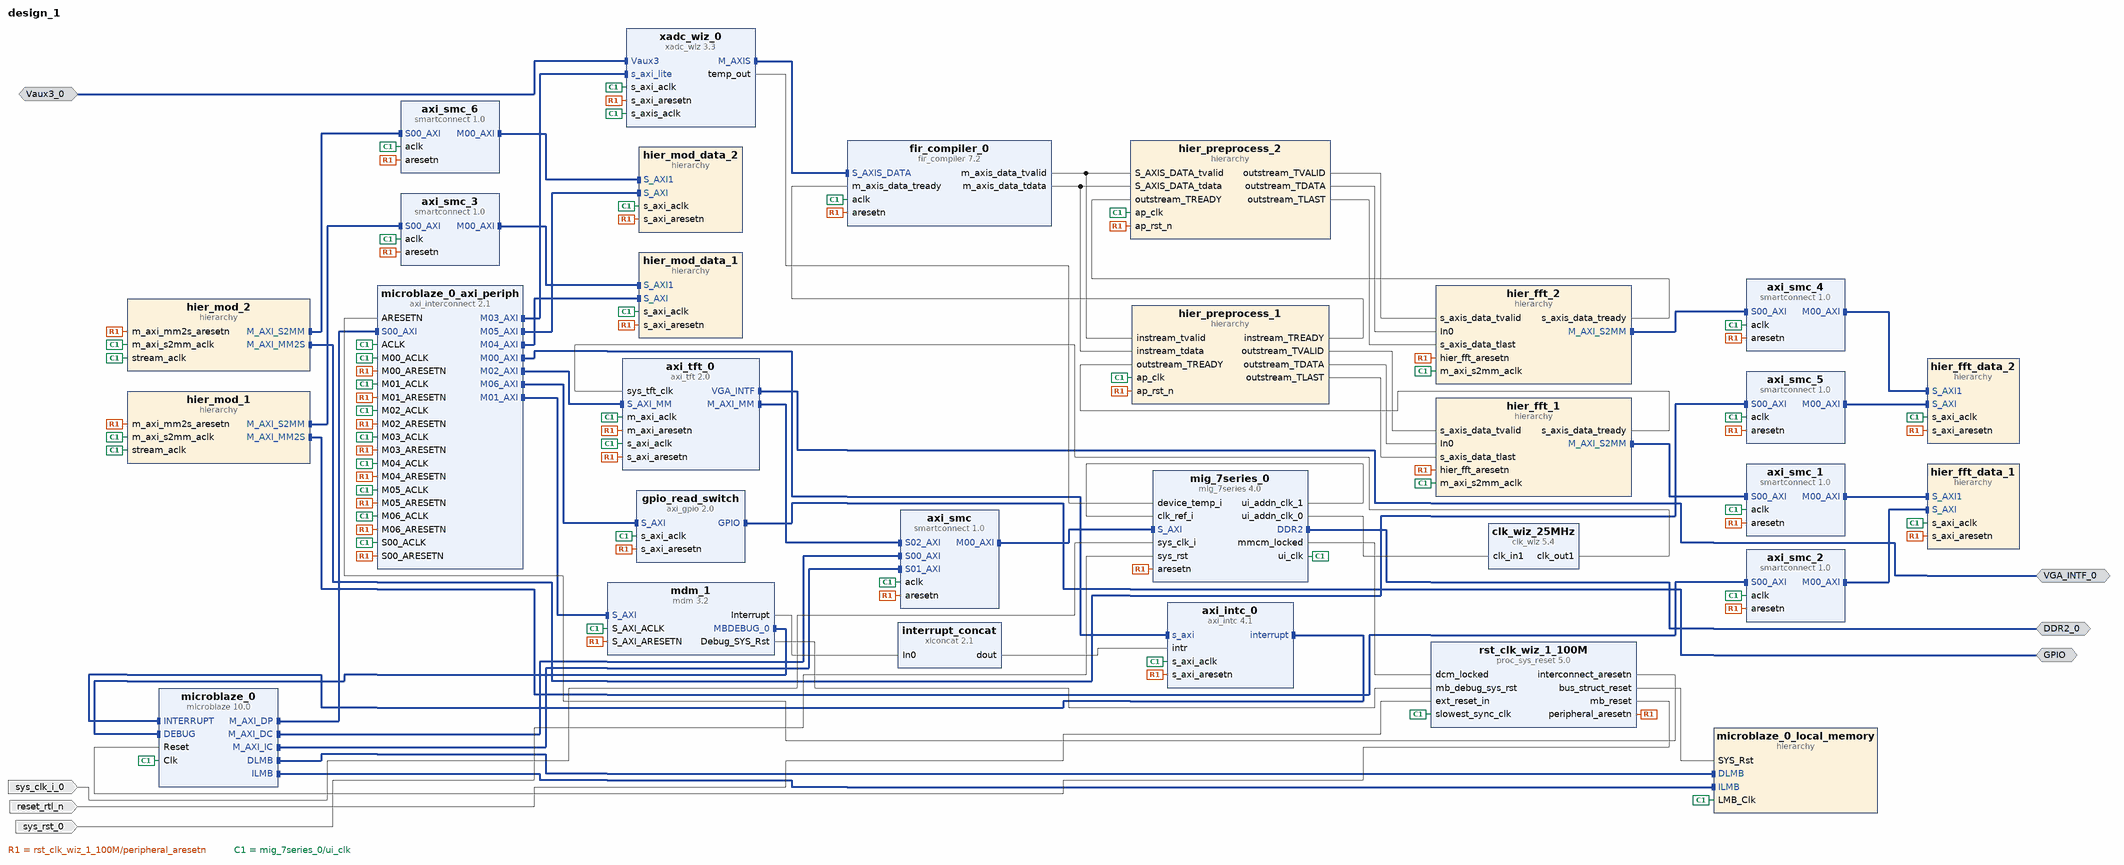
[diagram p0: block diagram of the top level]
# Vivado block design design_1, xc7a100tcsg324-1, Vivado 2017.4
create_bd_design design_1

create_bd_intf_port -mode Master -vlnv xilinx.com:interface:ddrx_rtl:1.0 DDR2_0
create_bd_intf_port -mode Master -vlnv xilinx.com:interface:vga_rtl:1.0 VGA_INTF_0
create_bd_intf_port -mode Slave -vlnv xilinx.com:interface:diff_analog_io_rtl:1.0 Vaux3_0
create_bd_intf_port -mode Master -vlnv xilinx.com:interface:gpio_rtl:1.0 GPIO
create_bd_port -dir I -type rst reset_rtl_n
set_property -dict {CONFIG.POLARITY ACTIVE_LOW} [get_bd_ports reset_rtl_n]
create_bd_port -dir I -type clk sys_clk_i_0
create_bd_port -dir I -type rst sys_rst_0

create_bd_cell -type ip -vlnv xilinx.com:ip:axi_interconnect:2.1 microblaze_0_axi_periph
set_property -dict {CONFIG.NUM_MI 7} [get_bd_cells microblaze_0_axi_periph]
create_bd_cell -type ip -vlnv xilinx.com:ip:xlconcat:2.1 interrupt_concat
set_property -dict {CONFIG.NUM_PORTS 1} [get_bd_cells interrupt_concat]
create_bd_cell -type ip -vlnv xilinx.com:ip:mig_7series:4.0 mig_7series_0
set_property -dict [list \
  CONFIG.XML_INPUT_FILE mig_b.prj \
  CONFIG.RESET_BOARD_INTERFACE Custom \
  CONFIG.BOARD_MIG_PARAM Custom \
] [get_bd_cells mig_7series_0]
create_bd_cell -type ip -vlnv xilinx.com:ip:axi_tft:2.0 axi_tft_0
set_property -dict [list \
  CONFIG.C_MAX_BURST_LEN 256 \
  CONFIG.C_M_AXI_DATA_WIDTH 128 \
  CONFIG.C_DEFAULT_TFT_BASE_ADDR 0x0000000087E00000 \
  CONFIG.C_EN_I2C_INTF 0 \
  CONFIG.C_TFT_INTERFACE 0 \
] [get_bd_cells axi_tft_0]
create_bd_cell -type ip -vlnv xilinx.com:ip:clk_wiz:5.4 clk_wiz_25MHz
set_property -dict [list \
  CONFIG.CLKOUT1_REQUESTED_OUT_FREQ 25 \
  CONFIG.USE_LOCKED false \
  CONFIG.USE_RESET false \
  CONFIG.RESET_PORT reset \
  CONFIG.MMCM_DIVCLK_DIVIDE 1 \
  CONFIG.MMCM_CLKFBOUT_MULT_F 9.125 \
  CONFIG.MMCM_CLKOUT0_DIVIDE_F 36.500 \
  CONFIG.RESET_TYPE ACTIVE_HIGH \
  CONFIG.CLKOUT1_JITTER 181.828 \
  CONFIG.CLKOUT1_PHASE_ERROR 104.359 \
] [get_bd_cells clk_wiz_25MHz]
create_bd_cell -type ip -vlnv xilinx.com:ip:smartconnect:1.0 axi_smc_1
set_property -dict {CONFIG.NUM_SI 1} [get_bd_cells axi_smc_1]
create_bd_cell -type hier hier_fft_1
create_bd_cell -type hier hier_fft_data_1
create_bd_cell -type ip -vlnv xilinx.com:ip:smartconnect:1.0 axi_smc_2
set_property -dict {CONFIG.NUM_SI 1} [get_bd_cells axi_smc_2]
create_bd_cell -type ip -vlnv xilinx.com:ip:smartconnect:1.0 axi_smc_3
set_property -dict {CONFIG.NUM_SI 1} [get_bd_cells axi_smc_3]
create_bd_cell -type hier hier_mod_1
create_bd_cell -type hier hier_mod_data_1
create_bd_cell -type ip -vlnv xilinx.com:ip:smartconnect:1.0 axi_smc
set_property -dict {CONFIG.NUM_SI 3} [get_bd_cells axi_smc]
create_bd_cell -type hier hier_preprocess_1
create_bd_cell -type ip -vlnv xilinx.com:ip:axi_intc:4.1 axi_intc_0
create_bd_cell -type ip -vlnv xilinx.com:ip:mdm:3.2 mdm_1
set_property -dict {CONFIG.C_USE_UART 1} [get_bd_cells mdm_1]
create_bd_cell -type ip -vlnv xilinx.com:ip:microblaze:10.0 microblaze_0
set_property -dict [list \
  CONFIG.C_D_AXI 1 \
  CONFIG.C_D_LMB 1 \
  CONFIG.C_I_LMB 1 \
  CONFIG.G_TEMPLATE_LIST 2 \
  CONFIG.C_USE_MSR_INSTR 1 \
  CONFIG.C_USE_PCMP_INSTR 1 \
  CONFIG.C_USE_BARREL 1 \
  CONFIG.C_USE_DIV 1 \
  CONFIG.C_USE_HW_MUL 1 \
  CONFIG.C_USE_FPU 1 \
  CONFIG.C_DEBUG_ENABLED 2 \
  CONFIG.C_USE_ICACHE 1 \
  CONFIG.C_ADDR_TAG_BITS 12 \
  CONFIG.C_CACHE_BYTE_SIZE 32768 \
  CONFIG.C_ICACHE_LINE_LEN 8 \
  CONFIG.C_ICACHE_VICTIMS 8 \
  CONFIG.C_ICACHE_STREAMS 1 \
  CONFIG.C_USE_DCACHE 1 \
  CONFIG.C_DCACHE_ADDR_TAG 12 \
  CONFIG.C_DCACHE_BYTE_SIZE 32768 \
  CONFIG.C_DCACHE_LINE_LEN 8 \
  CONFIG.C_DCACHE_USE_WRITEBACK 1 \
  CONFIG.C_DCACHE_VICTIMS 8 \
  CONFIG.C_USE_BRANCH_TARGET_CACHE 1 \
] [get_bd_cells microblaze_0]
create_bd_cell -type ip -vlnv xilinx.com:ip:proc_sys_reset:5.0 rst_clk_wiz_1_100M
create_bd_cell -type hier microblaze_0_local_memory
create_bd_cell -type ip -vlnv xilinx.com:ip:xadc_wiz:3.3 xadc_wiz_0
set_property -dict [list \
  CONFIG.XADC_STARUP_SELECTION simultaneous_sampling \
  CONFIG.DCLK_FREQUENCY 81.25 \
  CONFIG.ADC_CONVERSION_RATE 1000 \
  CONFIG.SEQUENCER_MODE Off \
  CONFIG.OT_ALARM false \
  CONFIG.USER_TEMP_ALARM false \
  CONFIG.VCCINT_ALARM false \
  CONFIG.VCCAUX_ALARM false \
  CONFIG.CHANNEL_ENABLE_TEMPERATURE true \
  CONFIG.CHANNEL_ENABLE_VP_VN true \
  CONFIG.CHANNEL_ENABLE_VAUXP3_VAUXN3 true \
  CONFIG.CHANNEL_ENABLE_VAUXP11_VAUXN11 true \
  CONFIG.BIPOLAR_VAUXP3_VAUXN3 true \
  CONFIG.BIPOLAR_VAUXP11_VAUXN11 true \
  CONFIG.ENABLE_TEMP_BUS true \
  CONFIG.ENABLE_AXI4STREAM true \
] [get_bd_cells xadc_wiz_0]
create_bd_cell -type hier hier_preprocess_2
create_bd_cell -type ip -vlnv xilinx.com:ip:fir_compiler:7.2 fir_compiler_0
set_property -dict [list \
  CONFIG.CoefficientSource COE_File \
  CONFIG.Coefficient_File {../../../../imports/MATLAB/coe file2.coe} \
  CONFIG.Coefficient_Sets 1 \
  CONFIG.Coefficient_Reload false \
  CONFIG.Filter_Type Decimation \
  CONFIG.Interpolation_Rate 1 \
  CONFIG.Decimation_Rate 4 \
  CONFIG.Zero_Pack_Factor 1 \
  CONFIG.Number_Channels 1 \
  CONFIG.RateSpecification Frequency_Specification \
  CONFIG.SamplePeriod 1 \
  CONFIG.Sample_Frequency 0.7812 \
  CONFIG.Clock_Frequency 81.25 \
  CONFIG.Coefficient_Sign Signed \
  CONFIG.Quantization Integer_Coefficients \
  CONFIG.Coefficient_Width 16 \
  CONFIG.Coefficient_Fractional_Bits 0 \
  CONFIG.Coefficient_Structure Inferred \
  CONFIG.Data_Width 16 \
  CONFIG.Output_Rounding_Mode Truncate_LSBs \
  CONFIG.Output_Width 16 \
  CONFIG.Filter_Architecture Systolic_Multiply_Accumulate \
  CONFIG.ColumnConfig 1 \
  CONFIG.M_DATA_Has_TREADY true \
  CONFIG.Has_ARESETn true \
  CONFIG.Reset_Data_Vector true \
] [get_bd_cells fir_compiler_0]
create_bd_cell -type hier hier_fft_2
create_bd_cell -type hier hier_fft_data_2
create_bd_cell -type hier hier_mod_2
create_bd_cell -type hier hier_mod_data_2
create_bd_cell -type ip -vlnv xilinx.com:ip:smartconnect:1.0 axi_smc_4
set_property -dict {CONFIG.NUM_SI 1} [get_bd_cells axi_smc_4]
create_bd_cell -type ip -vlnv xilinx.com:ip:smartconnect:1.0 axi_smc_5
set_property -dict {CONFIG.NUM_SI 1} [get_bd_cells axi_smc_5]
create_bd_cell -type ip -vlnv xilinx.com:ip:smartconnect:1.0 axi_smc_6
set_property -dict {CONFIG.NUM_SI 1} [get_bd_cells axi_smc_6]
create_bd_cell -type ip -vlnv xilinx.com:ip:axi_gpio:2.0 gpio_read_switch
set_property -dict {CONFIG.C_GPIO_WIDTH 14 CONFIG.C_ALL_INPUTS 1} [get_bd_cells gpio_read_switch]

# ---- hierarchy /hier_fft_1 ----
current_bd_instance /hier_fft_1
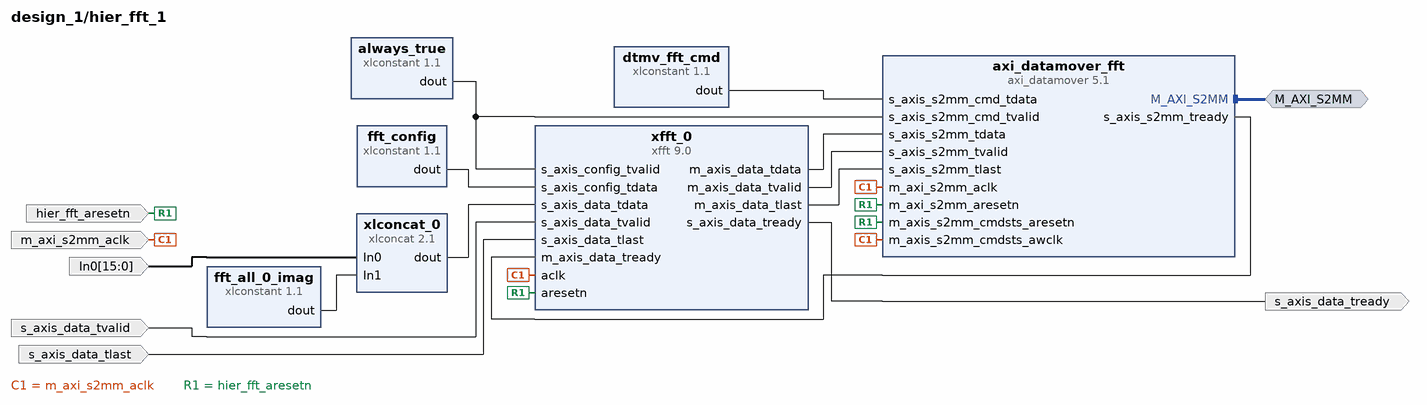
[diagram p1: block diagram inside /hier_fft_1]
create_bd_intf_pin -mode Master -vlnv xilinx.com:interface:aximm_rtl:1.0 M_AXI_S2MM
create_bd_pin -dir I -from 15 -to 0 In0
create_bd_pin -dir I -type clk m_axi_s2mm_aclk
create_bd_pin -dir I s_axis_data_tvalid
create_bd_pin -dir O s_axis_data_tready
create_bd_pin -dir I -type rst hier_fft_aresetn
create_bd_pin -dir I s_axis_data_tlast

create_bd_cell -type ip -vlnv xilinx.com:ip:xlconcat:2.1 xlconcat_0
create_bd_cell -type ip -vlnv xilinx.com:ip:xlconstant:1.1 dtmv_fft_cmd
set_property -dict {CONFIG.CONST_WIDTH 72 CONFIG.CONST_VAL 0x00C000000040802000} [get_bd_cells dtmv_fft_cmd]
create_bd_cell -type ip -vlnv xilinx.com:ip:xfft:9.0 xfft_0
set_property -dict [list \
  CONFIG.transform_length 2048 \
  CONFIG.target_clock_frequency 81 \
  CONFIG.implementation_options automatically_select \
  CONFIG.rounding_modes convergent_rounding \
  CONFIG.aresetn true \
  CONFIG.xk_index true \
  CONFIG.output_ordering natural_order \
  CONFIG.number_of_stages_using_block_ram_for_data_and_phase_factors 4 \
  CONFIG.complex_mult_type use_mults_performance \
] [get_bd_cells xfft_0]
create_bd_cell -type ip -vlnv xilinx.com:ip:xlconstant:1.1 fft_config
set_property -dict {CONFIG.CONST_WIDTH 16 CONFIG.CONST_VAL 0x03F5} [get_bd_cells fft_config]
create_bd_cell -type ip -vlnv xilinx.com:ip:xlconstant:1.1 always_true
create_bd_cell -type ip -vlnv xilinx.com:ip:xlconstant:1.1 fft_all_0_imag
set_property -dict {CONFIG.CONST_WIDTH 16 CONFIG.CONST_VAL 0} [get_bd_cells fft_all_0_imag]
create_bd_cell -type ip -vlnv xilinx.com:ip:axi_datamover:5.1 axi_datamover_fft
set_property -dict {CONFIG.c_s2mm_burst_size 256 CONFIG.c_enable_mm2s 0} [get_bd_cells axi_datamover_fft]

# ---- hierarchy /hier_fft_data_1 ----
current_bd_instance /hier_fft_data_1
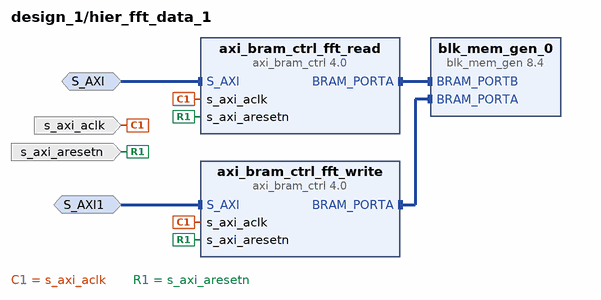
[diagram p2: block diagram inside /hier_fft_data_1]
create_bd_intf_pin -mode Slave -vlnv xilinx.com:interface:aximm_rtl:1.0 S_AXI
create_bd_intf_pin -mode Slave -vlnv xilinx.com:interface:aximm_rtl:1.0 S_AXI1
create_bd_pin -dir I -type clk s_axi_aclk
create_bd_pin -dir I -type rst s_axi_aresetn

create_bd_cell -type ip -vlnv xilinx.com:ip:axi_bram_ctrl:4.0 axi_bram_ctrl_fft_read
set_property -dict {CONFIG.SINGLE_PORT_BRAM 1} [get_bd_cells axi_bram_ctrl_fft_read]
create_bd_cell -type ip -vlnv xilinx.com:ip:axi_bram_ctrl:4.0 axi_bram_ctrl_fft_write
set_property -dict {CONFIG.SINGLE_PORT_BRAM 1} [get_bd_cells axi_bram_ctrl_fft_write]
create_bd_cell -type ip -vlnv xilinx.com:ip:blk_mem_gen:8.4 blk_mem_gen_0
set_property -dict [list \
  CONFIG.Memory_Type True_Dual_Port_RAM \
  CONFIG.Enable_B Use_ENB_Pin \
  CONFIG.Use_RSTB_Pin true \
  CONFIG.Port_B_Clock 100 \
  CONFIG.Port_B_Write_Rate 50 \
  CONFIG.Port_B_Enable_Rate 100 \
] [get_bd_cells blk_mem_gen_0]

# ---- hierarchy /hier_mod_1 ----
current_bd_instance /hier_mod_1
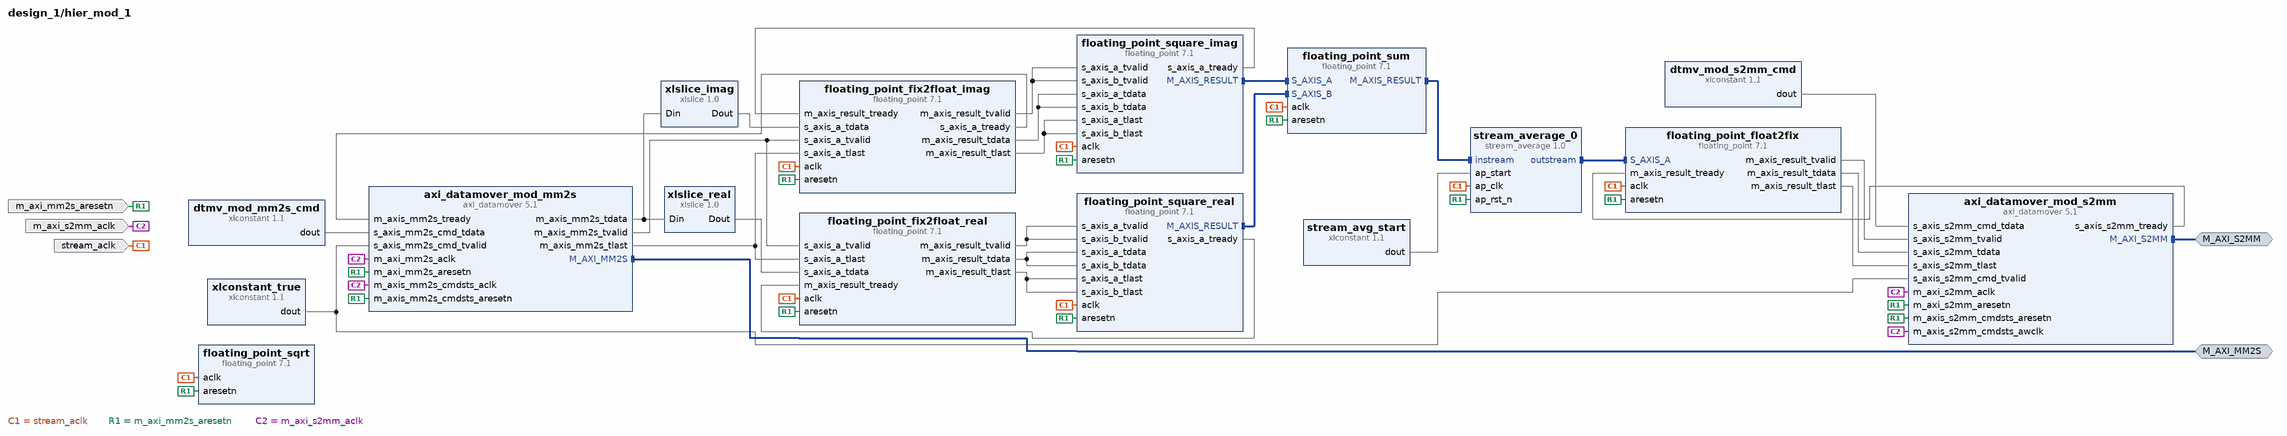
[diagram p3: block diagram inside /hier_mod_1]
create_bd_intf_pin -mode Master -vlnv xilinx.com:interface:aximm_rtl:1.0 M_AXI_MM2S
create_bd_intf_pin -mode Master -vlnv xilinx.com:interface:aximm_rtl:1.0 M_AXI_S2MM
create_bd_pin -dir I -type rst m_axi_mm2s_aresetn
create_bd_pin -dir I -type clk m_axi_s2mm_aclk
create_bd_pin -dir I stream_aclk

create_bd_cell -type ip -vlnv xilinx.com:ip:xlslice:1.0 xlslice_real
set_property -dict {CONFIG.DIN_TO 0 CONFIG.DIN_FROM 15 CONFIG.DOUT_WIDTH 16} [get_bd_cells xlslice_real]
create_bd_cell -type ip -vlnv xilinx.com:ip:floating_point:7.1 floating_point_square_real
set_property -dict [list \
  CONFIG.Operation_Type Multiply \
  CONFIG.Result_Precision_Type Single \
  CONFIG.C_Result_Exponent_Width 8 \
  CONFIG.C_Result_Fraction_Width 24 \
  CONFIG.C_Mult_Usage Full_Usage \
  CONFIG.Flow_Control Blocking \
  CONFIG.Axi_Optimize_Goal Resources \
  CONFIG.Has_RESULT_TREADY true \
  CONFIG.C_Latency 9 \
  CONFIG.C_Rate 1 \
  CONFIG.Has_ARESETn true \
  CONFIG.Has_A_TLAST true \
  CONFIG.Has_B_TLAST true \
  CONFIG.RESULT_TLAST_Behv Pass_A_TLAST \
] [get_bd_cells floating_point_square_real]
create_bd_cell -type ip -vlnv xilinx.com:ip:xlslice:1.0 xlslice_imag
set_property -dict {CONFIG.DIN_TO 16 CONFIG.DIN_FROM 31 CONFIG.DOUT_WIDTH 16} [get_bd_cells xlslice_imag]
create_bd_cell -type ip -vlnv xilinx.com:ip:floating_point:7.1 floating_point_square_imag
set_property -dict [list \
  CONFIG.Operation_Type Multiply \
  CONFIG.Result_Precision_Type Single \
  CONFIG.C_Result_Exponent_Width 8 \
  CONFIG.C_Result_Fraction_Width 24 \
  CONFIG.C_Mult_Usage Full_Usage \
  CONFIG.Flow_Control Blocking \
  CONFIG.Axi_Optimize_Goal Resources \
  CONFIG.Has_RESULT_TREADY true \
  CONFIG.Maximum_Latency true \
  CONFIG.C_Latency 9 \
  CONFIG.C_Rate 1 \
  CONFIG.Has_ARESETn true \
  CONFIG.Has_A_TLAST true \
  CONFIG.Has_B_TLAST true \
  CONFIG.RESULT_TLAST_Behv Pass_A_TLAST \
] [get_bd_cells floating_point_square_imag]
create_bd_cell -type ip -vlnv xilinx.com:ip:floating_point:7.1 floating_point_fix2float_real
set_property -dict [list \
  CONFIG.Operation_Type Fixed_to_float \
  CONFIG.A_Precision_Type Custom \
  CONFIG.C_A_Exponent_Width 16 \
  CONFIG.C_A_Fraction_Width 0 \
  CONFIG.Result_Precision_Type Single \
  CONFIG.C_Result_Exponent_Width 8 \
  CONFIG.C_Result_Fraction_Width 24 \
  CONFIG.C_Accum_Msb 32 \
  CONFIG.C_Accum_Lsb -1 \
  CONFIG.C_Accum_Input_Msb 0 \
  CONFIG.C_Mult_Usage No_Usage \
  CONFIG.Flow_Control Blocking \
  CONFIG.Axi_Optimize_Goal Resources \
  CONFIG.Has_RESULT_TREADY true \
  CONFIG.Maximum_Latency true \
  CONFIG.C_Latency 7 \
  CONFIG.C_Rate 1 \
  CONFIG.Has_ARESETn true \
  CONFIG.Has_A_TLAST true \
  CONFIG.Has_A_TUSER false \
  CONFIG.RESULT_TLAST_Behv Pass_A_TLAST \
] [get_bd_cells floating_point_fix2float_real]
create_bd_cell -type ip -vlnv xilinx.com:ip:xlconstant:1.1 dtmv_mod_mm2s_cmd
set_property -dict {CONFIG.CONST_WIDTH 72 CONFIG.CONST_VAL 0x00C000000040801000} [get_bd_cells dtmv_mod_mm2s_cmd]
create_bd_cell -type ip -vlnv xilinx.com:ip:floating_point:7.1 floating_point_sqrt
set_property -dict [list \
  CONFIG.Operation_Type Square_root \
  CONFIG.Result_Precision_Type Single \
  CONFIG.C_Result_Exponent_Width 8 \
  CONFIG.C_Result_Fraction_Width 24 \
  CONFIG.C_Mult_Usage No_Usage \
  CONFIG.C_Latency 29 \
  CONFIG.C_Rate 1 \
  CONFIG.Has_ARESETn true \
  CONFIG.Has_A_TLAST true \
  CONFIG.RESULT_TLAST_Behv Pass_A_TLAST \
] [get_bd_cells floating_point_sqrt]
create_bd_cell -type ip -vlnv xilinx.com:ip:floating_point:7.1 floating_point_float2fix
set_property -dict [list \
  CONFIG.Operation_Type Float_to_fixed \
  CONFIG.Result_Precision_Type Int32 \
  CONFIG.C_Result_Exponent_Width 32 \
  CONFIG.C_Result_Fraction_Width 0 \
  CONFIG.C_Mult_Usage No_Usage \
  CONFIG.C_Latency 7 \
  CONFIG.C_Rate 1 \
  CONFIG.Has_ARESETn true \
  CONFIG.Has_A_TLAST true \
  CONFIG.RESULT_TLAST_Behv Pass_A_TLAST \
] [get_bd_cells floating_point_float2fix]
create_bd_cell -type ip -vlnv xilinx.com:ip:floating_point:7.1 floating_point_sum
set_property -dict [list \
  CONFIG.Add_Sub_Value Add \
  CONFIG.C_Optimization Low_Latency \
  CONFIG.C_Mult_Usage No_Usage \
  CONFIG.C_Latency 9 \
  CONFIG.C_Rate 1 \
  CONFIG.Has_ARESETn true \
  CONFIG.Has_A_TLAST true \
  CONFIG.Has_B_TLAST true \
  CONFIG.RESULT_TLAST_Behv Pass_A_TLAST \
] [get_bd_cells floating_point_sum]
create_bd_cell -type ip -vlnv xilinx.com:ip:floating_point:7.1 floating_point_fix2float_imag
set_property -dict [list \
  CONFIG.Operation_Type Fixed_to_float \
  CONFIG.A_Precision_Type Custom \
  CONFIG.C_A_Exponent_Width 16 \
  CONFIG.C_A_Fraction_Width 0 \
  CONFIG.Result_Precision_Type Single \
  CONFIG.C_Result_Exponent_Width 8 \
  CONFIG.C_Result_Fraction_Width 24 \
  CONFIG.C_Accum_Msb 32 \
  CONFIG.C_Accum_Lsb -1 \
  CONFIG.C_Accum_Input_Msb 0 \
  CONFIG.C_Mult_Usage No_Usage \
  CONFIG.Flow_Control Blocking \
  CONFIG.Axi_Optimize_Goal Resources \
  CONFIG.Has_RESULT_TREADY true \
  CONFIG.Maximum_Latency false \
  CONFIG.C_Latency 7 \
  CONFIG.C_Rate 1 \
  CONFIG.Has_ARESETn true \
  CONFIG.Has_A_TLAST true \
  CONFIG.Has_A_TUSER false \
  CONFIG.RESULT_TLAST_Behv Pass_A_TLAST \
] [get_bd_cells floating_point_fix2float_imag]
create_bd_cell -type ip -vlnv xilinx.com:ip:xlconstant:1.1 xlconstant_true
create_bd_cell -type ip -vlnv xilinx.com:ip:axi_datamover:5.1 axi_datamover_mod_mm2s
set_property -dict {CONFIG.c_mm2s_burst_size 256 CONFIG.c_enable_s2mm 0} [get_bd_cells axi_datamover_mod_mm2s]
create_bd_cell -type ip -vlnv xilinx.com:ip:axi_datamover:5.1 axi_datamover_mod_s2mm
set_property -dict {CONFIG.c_s2mm_burst_size 256 CONFIG.c_enable_mm2s 0} [get_bd_cells axi_datamover_mod_s2mm]
create_bd_cell -type ip -vlnv xilinx.com:ip:xlconstant:1.1 dtmv_mod_s2mm_cmd
set_property -dict {CONFIG.CONST_WIDTH 72 CONFIG.CONST_VAL 0x00C200000040801000} [get_bd_cells dtmv_mod_s2mm_cmd]
create_bd_cell -type ip -vlnv xilinx.com:ip:xlconstant:1.1 stream_avg_start
create_bd_cell -type ip -vlnv xilinx.com:hls:stream_average:1.0 stream_average_0

# ---- hierarchy /hier_mod_data_1 ----
current_bd_instance /hier_mod_data_1
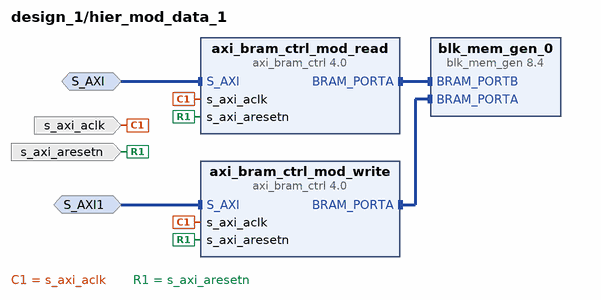
[diagram p4: block diagram inside /hier_mod_data_1]
create_bd_intf_pin -mode Slave -vlnv xilinx.com:interface:aximm_rtl:1.0 S_AXI
create_bd_intf_pin -mode Slave -vlnv xilinx.com:interface:aximm_rtl:1.0 S_AXI1
create_bd_pin -dir I -type clk s_axi_aclk
create_bd_pin -dir I -type rst s_axi_aresetn

create_bd_cell -type ip -vlnv xilinx.com:ip:axi_bram_ctrl:4.0 axi_bram_ctrl_mod_read
set_property -dict {CONFIG.SINGLE_PORT_BRAM 1} [get_bd_cells axi_bram_ctrl_mod_read]
create_bd_cell -type ip -vlnv xilinx.com:ip:axi_bram_ctrl:4.0 axi_bram_ctrl_mod_write
set_property -dict {CONFIG.SINGLE_PORT_BRAM 1} [get_bd_cells axi_bram_ctrl_mod_write]
create_bd_cell -type ip -vlnv xilinx.com:ip:blk_mem_gen:8.4 blk_mem_gen_0
set_property -dict [list \
  CONFIG.Memory_Type True_Dual_Port_RAM \
  CONFIG.Enable_B Use_ENB_Pin \
  CONFIG.Use_RSTB_Pin true \
  CONFIG.Port_A_Write_Rate 50 \
  CONFIG.Port_B_Clock 100 \
  CONFIG.Port_B_Write_Rate 50 \
  CONFIG.Port_B_Enable_Rate 100 \
] [get_bd_cells blk_mem_gen_0]

# ---- hierarchy /hier_preprocess_1 ----
current_bd_instance /hier_preprocess_1
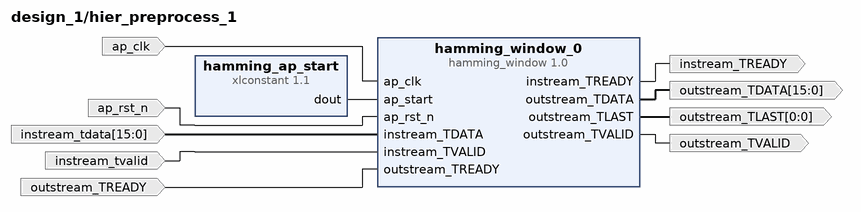
[diagram p5: block diagram inside /hier_preprocess_1]
create_bd_pin -dir I -type clk ap_clk
create_bd_pin -dir I -type rst ap_rst_n
create_bd_pin -dir O outstream_TVALID
create_bd_pin -dir O -from 15 -to 0 outstream_TDATA
create_bd_pin -dir O -from 0 -to 0 outstream_TLAST
create_bd_pin -dir I instream_tvalid
create_bd_pin -dir I -from 15 -to 0 instream_tdata
create_bd_pin -dir O instream_TREADY
create_bd_pin -dir I outstream_TREADY

create_bd_cell -type ip -vlnv xilinx.com:ip:xlconstant:1.1 hamming_ap_start
create_bd_cell -type ip -vlnv xilinx.com:hls:hamming_window:1.0 hamming_window_0

# ---- hierarchy /microblaze_0_local_memory ----
current_bd_instance /microblaze_0_local_memory
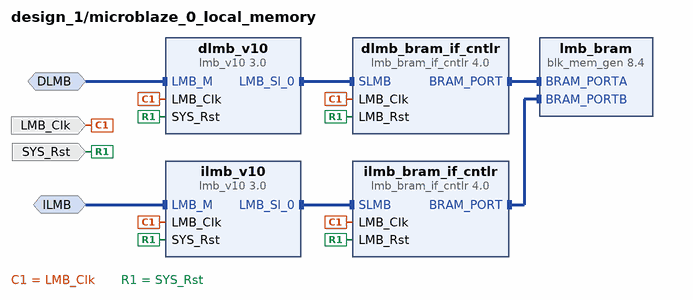
[diagram p6: block diagram inside /microblaze_0_local_memory]
create_bd_intf_pin -mode MirroredMaster -vlnv xilinx.com:interface:lmb_rtl:1.0 DLMB
create_bd_intf_pin -mode MirroredMaster -vlnv xilinx.com:interface:lmb_rtl:1.0 ILMB
create_bd_pin -dir I -type clk LMB_Clk
create_bd_pin -dir I -type rst SYS_Rst

create_bd_cell -type ip -vlnv xilinx.com:ip:lmb_v10:3.0 dlmb_v10
create_bd_cell -type ip -vlnv xilinx.com:ip:lmb_v10:3.0 ilmb_v10
create_bd_cell -type ip -vlnv xilinx.com:ip:lmb_bram_if_cntlr:4.0 dlmb_bram_if_cntlr
set_property -dict {CONFIG.C_ECC 0} [get_bd_cells dlmb_bram_if_cntlr]
create_bd_cell -type ip -vlnv xilinx.com:ip:lmb_bram_if_cntlr:4.0 ilmb_bram_if_cntlr
set_property -dict {CONFIG.C_ECC 0} [get_bd_cells ilmb_bram_if_cntlr]
create_bd_cell -type ip -vlnv xilinx.com:ip:blk_mem_gen:8.4 lmb_bram
set_property -dict {CONFIG.Memory_Type True_Dual_Port_RAM CONFIG.use_bram_block BRAM_Controller} [get_bd_cells lmb_bram]

# ---- hierarchy /hier_preprocess_2 ----
current_bd_instance /hier_preprocess_2
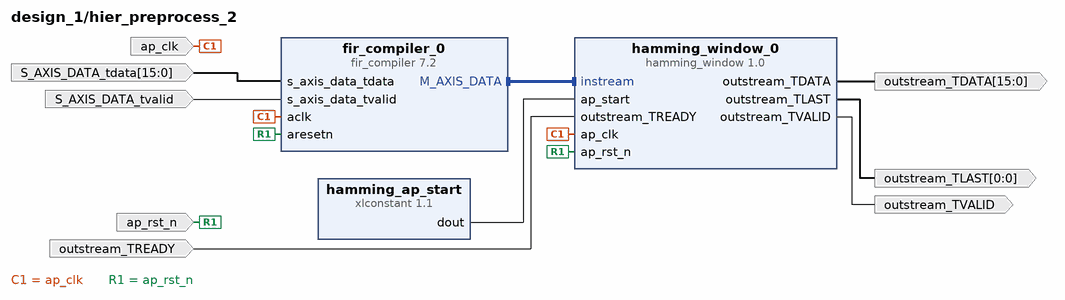
[diagram p7: block diagram inside /hier_preprocess_2]
create_bd_pin -dir I -type clk ap_clk
create_bd_pin -dir I -type rst ap_rst_n
create_bd_pin -dir O outstream_TVALID
create_bd_pin -dir I outstream_TREADY
create_bd_pin -dir O -from 15 -to 0 outstream_TDATA
create_bd_pin -dir O -from 0 -to 0 outstream_TLAST
create_bd_pin -dir I -from 15 -to 0 S_AXIS_DATA_tdata
create_bd_pin -dir I S_AXIS_DATA_tvalid

create_bd_cell -type ip -vlnv xilinx.com:ip:xlconstant:1.1 hamming_ap_start
create_bd_cell -type ip -vlnv xilinx.com:hls:hamming_window:1.0 hamming_window_0
create_bd_cell -type ip -vlnv xilinx.com:ip:fir_compiler:7.2 fir_compiler_0
set_property -dict [list \
  CONFIG.CoefficientSource COE_File \
  CONFIG.Coefficient_File {../../../../imports/MATLAB/coe file3.coe} \
  CONFIG.Coefficient_Sets 1 \
  CONFIG.Coefficient_Reload false \
  CONFIG.Filter_Type Decimation \
  CONFIG.Interpolation_Rate 1 \
  CONFIG.Decimation_Rate 4 \
  CONFIG.Zero_Pack_Factor 1 \
  CONFIG.Number_Channels 1 \
  CONFIG.RateSpecification Frequency_Specification \
  CONFIG.SamplePeriod 1 \
  CONFIG.Sample_Frequency 0.7812 \
  CONFIG.Clock_Frequency 81.25 \
  CONFIG.Coefficient_Sign Signed \
  CONFIG.Quantization Integer_Coefficients \
  CONFIG.Coefficient_Width 16 \
  CONFIG.Coefficient_Fractional_Bits 0 \
  CONFIG.Coefficient_Structure Inferred \
  CONFIG.Data_Width 16 \
  CONFIG.Output_Rounding_Mode Truncate_LSBs \
  CONFIG.Output_Width 16 \
  CONFIG.Filter_Architecture Systolic_Multiply_Accumulate \
  CONFIG.ColumnConfig 1 \
  CONFIG.M_DATA_Has_TREADY true \
  CONFIG.Has_ARESETn true \
  CONFIG.Reset_Data_Vector true \
] [get_bd_cells fir_compiler_0]

# ---- hierarchy /hier_fft_2 ----
current_bd_instance /hier_fft_2
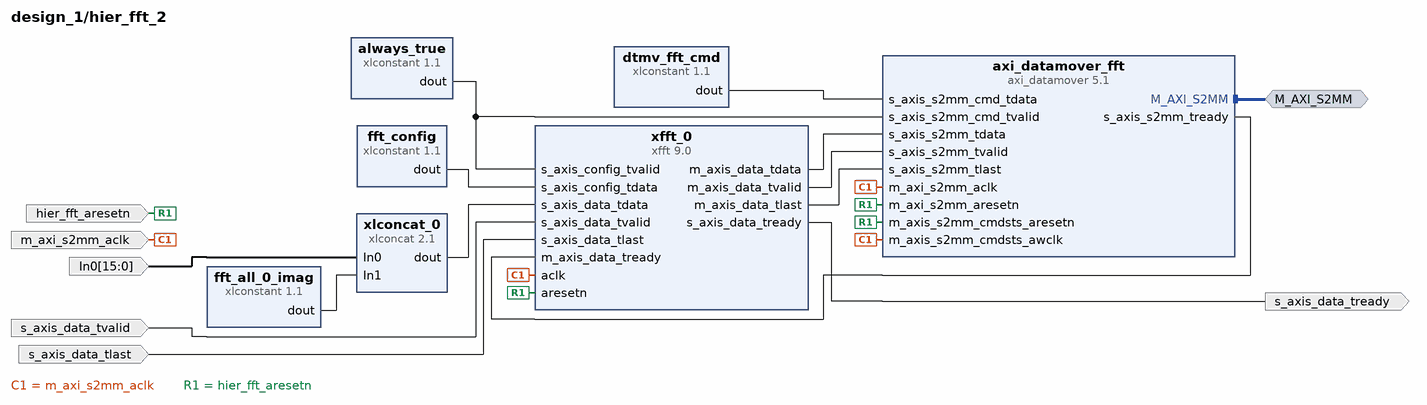
[diagram p8: block diagram inside /hier_fft_2]
create_bd_intf_pin -mode Master -vlnv xilinx.com:interface:aximm_rtl:1.0 M_AXI_S2MM
create_bd_pin -dir I -from 15 -to 0 In0
create_bd_pin -dir I -type clk m_axi_s2mm_aclk
create_bd_pin -dir I s_axis_data_tvalid
create_bd_pin -dir O s_axis_data_tready
create_bd_pin -dir I -type rst hier_fft_aresetn
create_bd_pin -dir I s_axis_data_tlast

create_bd_cell -type ip -vlnv xilinx.com:ip:xlconcat:2.1 xlconcat_0
create_bd_cell -type ip -vlnv xilinx.com:ip:xlconstant:1.1 dtmv_fft_cmd
set_property -dict {CONFIG.CONST_WIDTH 72 CONFIG.CONST_VAL 0x00C400000040802000} [get_bd_cells dtmv_fft_cmd]
create_bd_cell -type ip -vlnv xilinx.com:ip:xfft:9.0 xfft_0
set_property -dict [list \
  CONFIG.transform_length 2048 \
  CONFIG.target_clock_frequency 81 \
  CONFIG.implementation_options automatically_select \
  CONFIG.rounding_modes convergent_rounding \
  CONFIG.aresetn true \
  CONFIG.xk_index true \
  CONFIG.output_ordering natural_order \
  CONFIG.number_of_stages_using_block_ram_for_data_and_phase_factors 4 \
  CONFIG.complex_mult_type use_mults_performance \
] [get_bd_cells xfft_0]
create_bd_cell -type ip -vlnv xilinx.com:ip:xlconstant:1.1 fft_config
set_property -dict {CONFIG.CONST_WIDTH 16 CONFIG.CONST_VAL 0x03F5} [get_bd_cells fft_config]
create_bd_cell -type ip -vlnv xilinx.com:ip:xlconstant:1.1 always_true
create_bd_cell -type ip -vlnv xilinx.com:ip:xlconstant:1.1 fft_all_0_imag
set_property -dict {CONFIG.CONST_WIDTH 16 CONFIG.CONST_VAL 0} [get_bd_cells fft_all_0_imag]
create_bd_cell -type ip -vlnv xilinx.com:ip:axi_datamover:5.1 axi_datamover_fft
set_property -dict {CONFIG.c_s2mm_burst_size 256 CONFIG.c_enable_mm2s 0} [get_bd_cells axi_datamover_fft]

# ---- hierarchy /hier_fft_data_2 ----
current_bd_instance /hier_fft_data_2
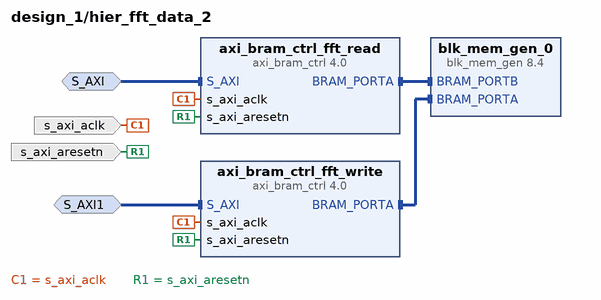
[diagram p9: block diagram inside /hier_fft_data_2]
create_bd_intf_pin -mode Slave -vlnv xilinx.com:interface:aximm_rtl:1.0 S_AXI
create_bd_intf_pin -mode Slave -vlnv xilinx.com:interface:aximm_rtl:1.0 S_AXI1
create_bd_pin -dir I -type clk s_axi_aclk
create_bd_pin -dir I -type rst s_axi_aresetn

create_bd_cell -type ip -vlnv xilinx.com:ip:axi_bram_ctrl:4.0 axi_bram_ctrl_fft_read
set_property -dict {CONFIG.SINGLE_PORT_BRAM 1} [get_bd_cells axi_bram_ctrl_fft_read]
create_bd_cell -type ip -vlnv xilinx.com:ip:axi_bram_ctrl:4.0 axi_bram_ctrl_fft_write
set_property -dict {CONFIG.SINGLE_PORT_BRAM 1} [get_bd_cells axi_bram_ctrl_fft_write]
create_bd_cell -type ip -vlnv xilinx.com:ip:blk_mem_gen:8.4 blk_mem_gen_0
set_property -dict [list \
  CONFIG.Memory_Type True_Dual_Port_RAM \
  CONFIG.Enable_B Use_ENB_Pin \
  CONFIG.Use_RSTB_Pin true \
  CONFIG.Port_B_Clock 100 \
  CONFIG.Port_B_Write_Rate 50 \
  CONFIG.Port_B_Enable_Rate 100 \
] [get_bd_cells blk_mem_gen_0]

# ---- hierarchy /hier_mod_2 ----
current_bd_instance /hier_mod_2
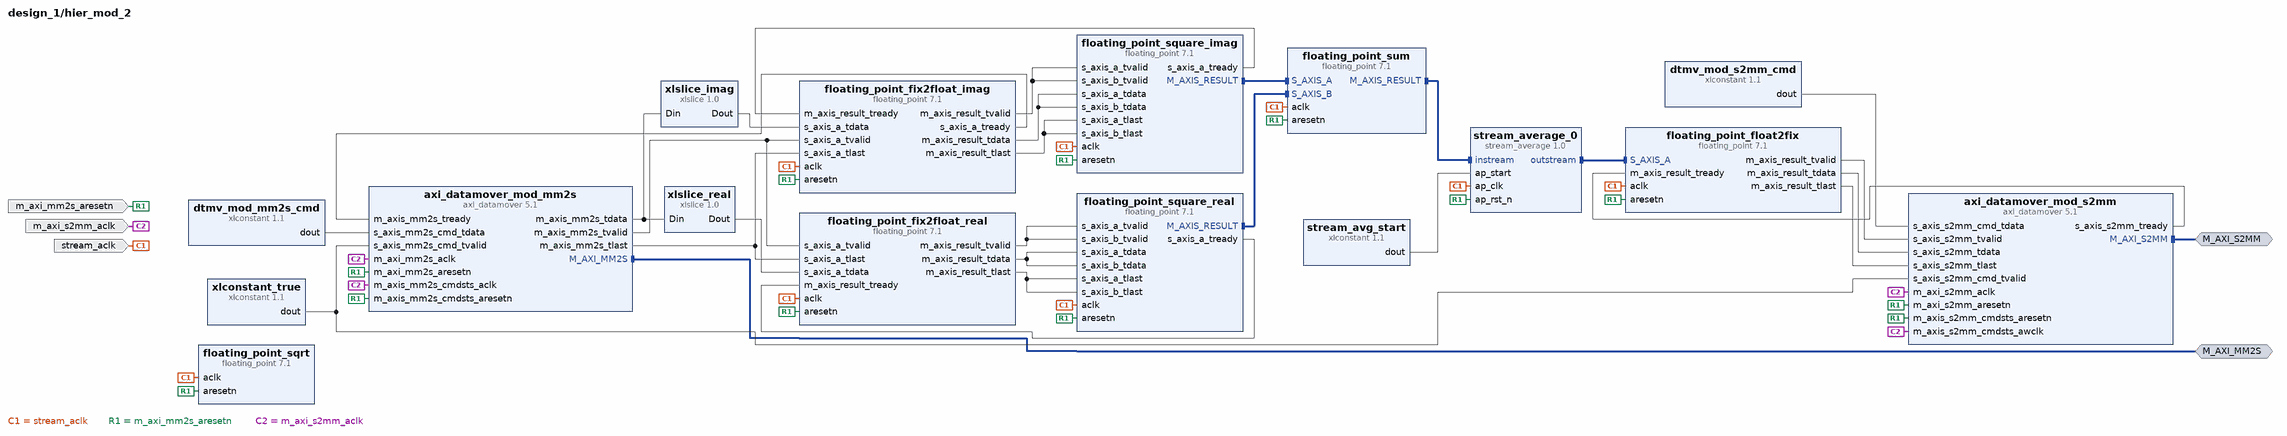
[diagram p10: block diagram inside /hier_mod_2]
create_bd_intf_pin -mode Master -vlnv xilinx.com:interface:aximm_rtl:1.0 M_AXI_MM2S
create_bd_intf_pin -mode Master -vlnv xilinx.com:interface:aximm_rtl:1.0 M_AXI_S2MM
create_bd_pin -dir I -type rst m_axi_mm2s_aresetn
create_bd_pin -dir I -type clk m_axi_s2mm_aclk
create_bd_pin -dir I stream_aclk

create_bd_cell -type ip -vlnv xilinx.com:ip:xlslice:1.0 xlslice_real
set_property -dict {CONFIG.DIN_TO 0 CONFIG.DIN_FROM 15 CONFIG.DOUT_WIDTH 16} [get_bd_cells xlslice_real]
create_bd_cell -type ip -vlnv xilinx.com:ip:floating_point:7.1 floating_point_square_real
set_property -dict [list \
  CONFIG.Operation_Type Multiply \
  CONFIG.Result_Precision_Type Single \
  CONFIG.C_Result_Exponent_Width 8 \
  CONFIG.C_Result_Fraction_Width 24 \
  CONFIG.C_Mult_Usage Full_Usage \
  CONFIG.Flow_Control Blocking \
  CONFIG.Axi_Optimize_Goal Resources \
  CONFIG.Has_RESULT_TREADY true \
  CONFIG.C_Latency 9 \
  CONFIG.C_Rate 1 \
  CONFIG.Has_ARESETn true \
  CONFIG.Has_A_TLAST true \
  CONFIG.Has_B_TLAST true \
  CONFIG.RESULT_TLAST_Behv Pass_A_TLAST \
] [get_bd_cells floating_point_square_real]
create_bd_cell -type ip -vlnv xilinx.com:ip:xlslice:1.0 xlslice_imag
set_property -dict {CONFIG.DIN_TO 16 CONFIG.DIN_FROM 31 CONFIG.DOUT_WIDTH 16} [get_bd_cells xlslice_imag]
create_bd_cell -type ip -vlnv xilinx.com:ip:floating_point:7.1 floating_point_square_imag
set_property -dict [list \
  CONFIG.Operation_Type Multiply \
  CONFIG.Result_Precision_Type Single \
  CONFIG.C_Result_Exponent_Width 8 \
  CONFIG.C_Result_Fraction_Width 24 \
  CONFIG.C_Mult_Usage Full_Usage \
  CONFIG.Flow_Control Blocking \
  CONFIG.Axi_Optimize_Goal Resources \
  CONFIG.Has_RESULT_TREADY true \
  CONFIG.Maximum_Latency true \
  CONFIG.C_Latency 9 \
  CONFIG.C_Rate 1 \
  CONFIG.Has_ARESETn true \
  CONFIG.Has_A_TLAST true \
  CONFIG.Has_B_TLAST true \
  CONFIG.RESULT_TLAST_Behv Pass_A_TLAST \
] [get_bd_cells floating_point_square_imag]
create_bd_cell -type ip -vlnv xilinx.com:ip:floating_point:7.1 floating_point_fix2float_real
set_property -dict [list \
  CONFIG.Operation_Type Fixed_to_float \
  CONFIG.A_Precision_Type Custom \
  CONFIG.C_A_Exponent_Width 16 \
  CONFIG.C_A_Fraction_Width 0 \
  CONFIG.Result_Precision_Type Single \
  CONFIG.C_Result_Exponent_Width 8 \
  CONFIG.C_Result_Fraction_Width 24 \
  CONFIG.C_Accum_Msb 32 \
  CONFIG.C_Accum_Lsb -1 \
  CONFIG.C_Accum_Input_Msb 0 \
  CONFIG.C_Mult_Usage No_Usage \
  CONFIG.Flow_Control Blocking \
  CONFIG.Axi_Optimize_Goal Resources \
  CONFIG.Has_RESULT_TREADY true \
  CONFIG.Maximum_Latency true \
  CONFIG.C_Latency 7 \
  CONFIG.C_Rate 1 \
  CONFIG.Has_ARESETn true \
  CONFIG.Has_A_TLAST true \
  CONFIG.Has_A_TUSER false \
  CONFIG.RESULT_TLAST_Behv Pass_A_TLAST \
] [get_bd_cells floating_point_fix2float_real]
create_bd_cell -type ip -vlnv xilinx.com:ip:xlconstant:1.1 dtmv_mod_mm2s_cmd
set_property -dict {CONFIG.CONST_WIDTH 72 CONFIG.CONST_VAL 0x00C400000040801000} [get_bd_cells dtmv_mod_mm2s_cmd]
create_bd_cell -type ip -vlnv xilinx.com:ip:floating_point:7.1 floating_point_sqrt
set_property -dict [list \
  CONFIG.Operation_Type Square_root \
  CONFIG.Result_Precision_Type Single \
  CONFIG.C_Result_Exponent_Width 8 \
  CONFIG.C_Result_Fraction_Width 24 \
  CONFIG.C_Mult_Usage No_Usage \
  CONFIG.C_Latency 29 \
  CONFIG.C_Rate 1 \
  CONFIG.Has_ARESETn true \
  CONFIG.Has_A_TLAST true \
  CONFIG.RESULT_TLAST_Behv Pass_A_TLAST \
] [get_bd_cells floating_point_sqrt]
create_bd_cell -type ip -vlnv xilinx.com:ip:floating_point:7.1 floating_point_float2fix
set_property -dict [list \
  CONFIG.Operation_Type Float_to_fixed \
  CONFIG.Result_Precision_Type Int32 \
  CONFIG.C_Result_Exponent_Width 32 \
  CONFIG.C_Result_Fraction_Width 0 \
  CONFIG.C_Mult_Usage No_Usage \
  CONFIG.C_Latency 7 \
  CONFIG.C_Rate 1 \
  CONFIG.Has_ARESETn true \
  CONFIG.Has_A_TLAST true \
  CONFIG.RESULT_TLAST_Behv Pass_A_TLAST \
] [get_bd_cells floating_point_float2fix]
create_bd_cell -type ip -vlnv xilinx.com:ip:floating_point:7.1 floating_point_sum
set_property -dict [list \
  CONFIG.Add_Sub_Value Add \
  CONFIG.C_Optimization Low_Latency \
  CONFIG.C_Mult_Usage No_Usage \
  CONFIG.C_Latency 9 \
  CONFIG.C_Rate 1 \
  CONFIG.Has_ARESETn true \
  CONFIG.Has_A_TLAST true \
  CONFIG.Has_B_TLAST true \
  CONFIG.RESULT_TLAST_Behv Pass_A_TLAST \
] [get_bd_cells floating_point_sum]
create_bd_cell -type ip -vlnv xilinx.com:ip:floating_point:7.1 floating_point_fix2float_imag
set_property -dict [list \
  CONFIG.Operation_Type Fixed_to_float \
  CONFIG.A_Precision_Type Custom \
  CONFIG.C_A_Exponent_Width 16 \
  CONFIG.C_A_Fraction_Width 0 \
  CONFIG.Result_Precision_Type Single \
  CONFIG.C_Result_Exponent_Width 8 \
  CONFIG.C_Result_Fraction_Width 24 \
  CONFIG.C_Accum_Msb 32 \
  CONFIG.C_Accum_Lsb -1 \
  CONFIG.C_Accum_Input_Msb 0 \
  CONFIG.C_Mult_Usage No_Usage \
  CONFIG.Flow_Control Blocking \
  CONFIG.Axi_Optimize_Goal Resources \
  CONFIG.Has_RESULT_TREADY true \
  CONFIG.Maximum_Latency false \
  CONFIG.C_Latency 7 \
  CONFIG.C_Rate 1 \
  CONFIG.Has_ARESETn true \
  CONFIG.Has_A_TLAST true \
  CONFIG.Has_A_TUSER false \
  CONFIG.RESULT_TLAST_Behv Pass_A_TLAST \
] [get_bd_cells floating_point_fix2float_imag]
create_bd_cell -type ip -vlnv xilinx.com:ip:xlconstant:1.1 xlconstant_true
create_bd_cell -type ip -vlnv xilinx.com:ip:axi_datamover:5.1 axi_datamover_mod_mm2s
set_property -dict {CONFIG.c_mm2s_burst_size 256 CONFIG.c_enable_s2mm 0} [get_bd_cells axi_datamover_mod_mm2s]
create_bd_cell -type ip -vlnv xilinx.com:ip:axi_datamover:5.1 axi_datamover_mod_s2mm
set_property -dict {CONFIG.c_s2mm_burst_size 256 CONFIG.c_enable_mm2s 0} [get_bd_cells axi_datamover_mod_s2mm]
create_bd_cell -type ip -vlnv xilinx.com:ip:xlconstant:1.1 dtmv_mod_s2mm_cmd
set_property -dict {CONFIG.CONST_WIDTH 72 CONFIG.CONST_VAL 0x00C600000040801000} [get_bd_cells dtmv_mod_s2mm_cmd]
create_bd_cell -type ip -vlnv xilinx.com:ip:xlconstant:1.1 stream_avg_start
create_bd_cell -type ip -vlnv xilinx.com:hls:stream_average:1.0 stream_average_0

# ---- hierarchy /hier_mod_data_2 ----
current_bd_instance /hier_mod_data_2
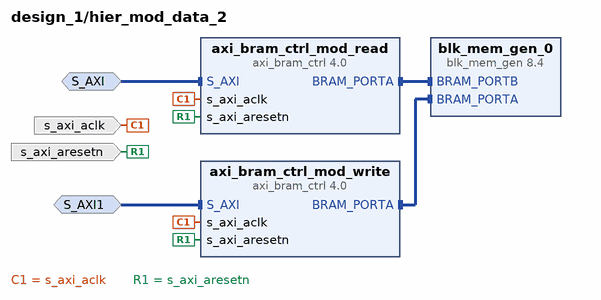
[diagram p11: block diagram inside /hier_mod_data_2]
create_bd_intf_pin -mode Slave -vlnv xilinx.com:interface:aximm_rtl:1.0 S_AXI
create_bd_intf_pin -mode Slave -vlnv xilinx.com:interface:aximm_rtl:1.0 S_AXI1
create_bd_pin -dir I -type clk s_axi_aclk
create_bd_pin -dir I -type rst s_axi_aresetn

create_bd_cell -type ip -vlnv xilinx.com:ip:axi_bram_ctrl:4.0 axi_bram_ctrl_mod_read
set_property -dict {CONFIG.SINGLE_PORT_BRAM 1} [get_bd_cells axi_bram_ctrl_mod_read]
create_bd_cell -type ip -vlnv xilinx.com:ip:axi_bram_ctrl:4.0 axi_bram_ctrl_mod_write
set_property -dict {CONFIG.SINGLE_PORT_BRAM 1} [get_bd_cells axi_bram_ctrl_mod_write]
create_bd_cell -type ip -vlnv xilinx.com:ip:blk_mem_gen:8.4 blk_mem_gen_0
set_property -dict [list \
  CONFIG.Memory_Type True_Dual_Port_RAM \
  CONFIG.Enable_B Use_ENB_Pin \
  CONFIG.Use_RSTB_Pin true \
  CONFIG.Port_A_Write_Rate 50 \
  CONFIG.Port_B_Clock 100 \
  CONFIG.Port_B_Write_Rate 50 \
  CONFIG.Port_B_Enable_Rate 100 \
] [get_bd_cells blk_mem_gen_0]

# ---- connections ----

current_bd_instance /hier_fft_1
connect_bd_intf_net [get_bd_intf_pins M_AXI_S2MM] [get_bd_intf_pins axi_datamover_fft/M_AXI_S2MM]
connect_bd_net [get_bd_pins fft_all_0_imag/dout] [get_bd_pins xlconcat_0/In1]
connect_bd_net [get_bd_pins xlconcat_0/dout] [get_bd_pins xfft_0/s_axis_data_tdata]
connect_bd_net -net xlconstant_0_dout [get_bd_pins dtmv_fft_cmd/dout] [get_bd_pins axi_datamover_fft/s_axis_s2mm_cmd_tdata]
connect_bd_net [get_bd_pins fft_config/dout] [get_bd_pins xfft_0/s_axis_config_tdata]
connect_bd_net [get_bd_pins always_true/dout] [get_bd_pins xfft_0/s_axis_config_tvalid] [get_bd_pins axi_datamover_fft/s_axis_s2mm_cmd_tvalid]
connect_bd_net [get_bd_pins xfft_0/m_axis_data_tdata] [get_bd_pins axi_datamover_fft/s_axis_s2mm_tdata]
connect_bd_net [get_bd_pins xfft_0/m_axis_data_tvalid] [get_bd_pins axi_datamover_fft/s_axis_s2mm_tvalid]
connect_bd_net -net axi_datamover_0_s_axis_s2mm_tready [get_bd_pins axi_datamover_fft/s_axis_s2mm_tready] [get_bd_pins xfft_0/m_axis_data_tready]
connect_bd_net [get_bd_pins xfft_0/m_axis_data_tlast] [get_bd_pins axi_datamover_fft/s_axis_s2mm_tlast]
connect_bd_net -net xadc_wiz_0_m_axis_tdata [get_bd_pins In0] [get_bd_pins xlconcat_0/In0]
connect_bd_net -net microblaze_0_Clk [get_bd_pins m_axi_s2mm_aclk] \
  [get_bd_pins axi_datamover_fft/m_axi_s2mm_aclk] [get_bd_pins axi_datamover_fft/m_axis_s2mm_cmdsts_awclk] \
  [get_bd_pins xfft_0/aclk]
connect_bd_net -net xadc_wiz_0_m_axis_tvalid [get_bd_pins s_axis_data_tvalid] [get_bd_pins xfft_0/s_axis_data_tvalid]
connect_bd_net [get_bd_pins xfft_0/s_axis_data_tready] [get_bd_pins s_axis_data_tready]
connect_bd_net -net rst_clk_wiz_1_100M_peripheral_aresetn [get_bd_pins hier_fft_aresetn] \
  [get_bd_pins axi_datamover_fft/m_axi_s2mm_aresetn] [get_bd_pins axi_datamover_fft/m_axis_s2mm_cmdsts_aresetn] \
  [get_bd_pins xfft_0/aresetn]
connect_bd_net -net s_axis_data_tlast_0_1 [get_bd_pins s_axis_data_tlast] [get_bd_pins xfft_0/s_axis_data_tlast]

current_bd_instance /hier_fft_data_1
connect_bd_intf_net [get_bd_intf_pins axi_bram_ctrl_fft_read/BRAM_PORTA] [get_bd_intf_pins blk_mem_gen_0/BRAM_PORTB]
connect_bd_intf_net [get_bd_intf_pins axi_bram_ctrl_fft_write/BRAM_PORTA] [get_bd_intf_pins blk_mem_gen_0/BRAM_PORTA]
connect_bd_intf_net [get_bd_intf_pins S_AXI] [get_bd_intf_pins axi_bram_ctrl_fft_read/S_AXI]
connect_bd_intf_net [get_bd_intf_pins S_AXI1] [get_bd_intf_pins axi_bram_ctrl_fft_write/S_AXI]
connect_bd_net -net microblaze_0_Clk [get_bd_pins s_axi_aclk] \
  [get_bd_pins axi_bram_ctrl_fft_write/s_axi_aclk] [get_bd_pins axi_bram_ctrl_fft_read/s_axi_aclk]
connect_bd_net -net rst_clk_wiz_1_100M_peripheral_aresetn [get_bd_pins s_axi_aresetn] \
  [get_bd_pins axi_bram_ctrl_fft_write/s_axi_aresetn] [get_bd_pins axi_bram_ctrl_fft_read/s_axi_aresetn]

current_bd_instance /hier_mod_1
connect_bd_intf_net [get_bd_intf_pins floating_point_square_real/M_AXIS_RESULT] [get_bd_intf_pins floating_point_sum/S_AXIS_B]
connect_bd_intf_net [get_bd_intf_pins floating_point_square_imag/M_AXIS_RESULT] [get_bd_intf_pins floating_point_sum/S_AXIS_A]
connect_bd_intf_net [get_bd_intf_pins stream_average_0/outstream] [get_bd_intf_pins floating_point_float2fix/S_AXIS_A]
connect_bd_intf_net [get_bd_intf_pins floating_point_sum/M_AXIS_RESULT] [get_bd_intf_pins stream_average_0/instream]
connect_bd_intf_net [get_bd_intf_pins M_AXI_MM2S] [get_bd_intf_pins axi_datamover_mod_mm2s/M_AXI_MM2S]
connect_bd_intf_net [get_bd_intf_pins M_AXI_S2MM] [get_bd_intf_pins axi_datamover_mod_s2mm/M_AXI_S2MM]
connect_bd_net -net axi_datamover_0_m_axis_mm2s_tdata [get_bd_pins axi_datamover_mod_mm2s/m_axis_mm2s_tdata] \
  [get_bd_pins xlslice_imag/Din] [get_bd_pins xlslice_real/Din]
connect_bd_net [get_bd_pins xlslice_real/Dout] [get_bd_pins floating_point_fix2float_real/s_axis_a_tdata]
connect_bd_net [get_bd_pins stream_aclk] \
  [get_bd_pins floating_point_float2fix/aclk] [get_bd_pins floating_point_sqrt/aclk] [get_bd_pins floating_point_sum/aclk] \
  [get_bd_pins floating_point_square_real/aclk] [get_bd_pins floating_point_square_imag/aclk] \
  [get_bd_pins floating_point_fix2float_imag/aclk] [get_bd_pins floating_point_fix2float_real/aclk] \
  [get_bd_pins stream_average_0/ap_clk]
connect_bd_net [get_bd_pins floating_point_fix2float_real/m_axis_result_tvalid] \
  [get_bd_pins floating_point_square_real/s_axis_a_tvalid] [get_bd_pins floating_point_square_real/s_axis_b_tvalid]
connect_bd_net [get_bd_pins floating_point_square_real/s_axis_a_tready] [get_bd_pins floating_point_fix2float_real/m_axis_result_tready]
connect_bd_net [get_bd_pins floating_point_fix2float_real/m_axis_result_tdata] \
  [get_bd_pins floating_point_square_real/s_axis_a_tdata] [get_bd_pins floating_point_square_real/s_axis_b_tdata]
connect_bd_net [get_bd_pins floating_point_fix2float_real/m_axis_result_tlast] \
  [get_bd_pins floating_point_square_real/s_axis_a_tlast] [get_bd_pins floating_point_square_real/s_axis_b_tlast]
connect_bd_net [get_bd_pins xlslice_imag/Dout] [get_bd_pins floating_point_fix2float_imag/s_axis_a_tdata]
connect_bd_net [get_bd_pins floating_point_fix2float_imag/m_axis_result_tvalid] \
  [get_bd_pins floating_point_square_imag/s_axis_a_tvalid] [get_bd_pins floating_point_square_imag/s_axis_b_tvalid]
connect_bd_net [get_bd_pins floating_point_square_imag/s_axis_a_tready] [get_bd_pins floating_point_fix2float_imag/m_axis_result_tready]
connect_bd_net [get_bd_pins floating_point_fix2float_imag/m_axis_result_tdata] \
  [get_bd_pins floating_point_square_imag/s_axis_a_tdata] [get_bd_pins floating_point_square_imag/s_axis_b_tdata]
connect_bd_net [get_bd_pins floating_point_fix2float_imag/m_axis_result_tlast] \
  [get_bd_pins floating_point_square_imag/s_axis_a_tlast] [get_bd_pins floating_point_square_imag/s_axis_b_tlast]
connect_bd_net [get_bd_pins axi_datamover_mod_mm2s/m_axis_mm2s_tvalid] \
  [get_bd_pins floating_point_fix2float_real/s_axis_a_tvalid] [get_bd_pins floating_point_fix2float_imag/s_axis_a_tvalid]
connect_bd_net -net axi_datamover_0_m_axis_mm2s_tlast [get_bd_pins axi_datamover_mod_mm2s/m_axis_mm2s_tlast] \
  [get_bd_pins floating_point_fix2float_imag/s_axis_a_tlast] [get_bd_pins floating_point_fix2float_real/s_axis_a_tlast]
connect_bd_net [get_bd_pins dtmv_mod_mm2s_cmd/dout] [get_bd_pins axi_datamover_mod_mm2s/s_axis_mm2s_cmd_tdata]
connect_bd_net [get_bd_pins floating_point_float2fix/m_axis_result_tvalid] [get_bd_pins axi_datamover_mod_s2mm/s_axis_s2mm_tvalid]
connect_bd_net [get_bd_pins axi_datamover_mod_s2mm/s_axis_s2mm_tready] [get_bd_pins floating_point_float2fix/m_axis_result_tready]
connect_bd_net [get_bd_pins floating_point_float2fix/m_axis_result_tdata] [get_bd_pins axi_datamover_mod_s2mm/s_axis_s2mm_tdata]
connect_bd_net [get_bd_pins floating_point_float2fix/m_axis_result_tlast] [get_bd_pins axi_datamover_mod_s2mm/s_axis_s2mm_tlast]
connect_bd_net [get_bd_pins floating_point_fix2float_imag/s_axis_a_tready] [get_bd_pins axi_datamover_mod_mm2s/m_axis_mm2s_tready]
connect_bd_net [get_bd_pins xlconstant_true/dout] \
  [get_bd_pins axi_datamover_mod_mm2s/s_axis_mm2s_cmd_tvalid] [get_bd_pins axi_datamover_mod_s2mm/s_axis_s2mm_cmd_tvalid]
connect_bd_net -net rst_clk_wiz_1_100M_peripheral_aresetn [get_bd_pins m_axi_mm2s_aresetn] \
  [get_bd_pins axi_datamover_mod_mm2s/m_axi_mm2s_aresetn] [get_bd_pins axi_datamover_mod_s2mm/m_axi_s2mm_aresetn] \
  [get_bd_pins axi_datamover_mod_mm2s/m_axis_mm2s_cmdsts_aresetn] [get_bd_pins floating_point_float2fix/aresetn] \
  [get_bd_pins axi_datamover_mod_s2mm/m_axis_s2mm_cmdsts_aresetn] [get_bd_pins floating_point_sqrt/aresetn] \
  [get_bd_pins floating_point_sum/aresetn] [get_bd_pins floating_point_square_imag/aresetn] \
  [get_bd_pins floating_point_fix2float_real/aresetn] [get_bd_pins floating_point_fix2float_imag/aresetn] \
  [get_bd_pins floating_point_square_real/aresetn] [get_bd_pins stream_average_0/ap_rst_n]
connect_bd_net -net microblaze_0_Clk [get_bd_pins m_axi_s2mm_aclk] \
  [get_bd_pins axi_datamover_mod_s2mm/m_axi_s2mm_aclk] [get_bd_pins axi_datamover_mod_s2mm/m_axis_s2mm_cmdsts_awclk] \
  [get_bd_pins axi_datamover_mod_mm2s/m_axis_mm2s_cmdsts_aclk] [get_bd_pins axi_datamover_mod_mm2s/m_axi_mm2s_aclk]
connect_bd_net -net dtmv_mod_mm2s_cmd1_dout [get_bd_pins dtmv_mod_s2mm_cmd/dout] [get_bd_pins axi_datamover_mod_s2mm/s_axis_s2mm_cmd_tdata]
connect_bd_net [get_bd_pins stream_avg_start/dout] [get_bd_pins stream_average_0/ap_start]

current_bd_instance /hier_mod_data_1
connect_bd_intf_net [get_bd_intf_pins axi_bram_ctrl_mod_read/BRAM_PORTA] [get_bd_intf_pins blk_mem_gen_0/BRAM_PORTB]
connect_bd_intf_net [get_bd_intf_pins axi_bram_ctrl_mod_write/BRAM_PORTA] [get_bd_intf_pins blk_mem_gen_0/BRAM_PORTA]
connect_bd_intf_net [get_bd_intf_pins S_AXI] [get_bd_intf_pins axi_bram_ctrl_mod_read/S_AXI]
connect_bd_intf_net [get_bd_intf_pins S_AXI1] [get_bd_intf_pins axi_bram_ctrl_mod_write/S_AXI]
connect_bd_net -net microblaze_0_Clk [get_bd_pins s_axi_aclk] \
  [get_bd_pins axi_bram_ctrl_mod_write/s_axi_aclk] [get_bd_pins axi_bram_ctrl_mod_read/s_axi_aclk]
connect_bd_net -net rst_clk_wiz_1_100M_peripheral_aresetn [get_bd_pins s_axi_aresetn] \
  [get_bd_pins axi_bram_ctrl_mod_write/s_axi_aresetn] [get_bd_pins axi_bram_ctrl_mod_read/s_axi_aresetn]

current_bd_instance /hier_preprocess_1
connect_bd_net [get_bd_pins hamming_ap_start/dout] [get_bd_pins hamming_window_0/ap_start]
connect_bd_net -net microblaze_0_Clk [get_bd_pins ap_clk] [get_bd_pins hamming_window_0/ap_clk]
connect_bd_net -net rst_clk_wiz_1_100M_peripheral_aresetn [get_bd_pins ap_rst_n] [get_bd_pins hamming_window_0/ap_rst_n]
connect_bd_net [get_bd_pins hamming_window_0/outstream_TVALID] [get_bd_pins outstream_TVALID]
connect_bd_net [get_bd_pins hamming_window_0/outstream_TDATA] [get_bd_pins outstream_TDATA]
connect_bd_net -net s_axis_data_tlast_1 [get_bd_pins hamming_window_0/outstream_TLAST] [get_bd_pins outstream_TLAST]
connect_bd_net [get_bd_pins instream_tdata] [get_bd_pins hamming_window_0/instream_TDATA]
connect_bd_net [get_bd_pins instream_tvalid] [get_bd_pins hamming_window_0/instream_TVALID]
connect_bd_net [get_bd_pins hamming_window_0/instream_TREADY] [get_bd_pins instream_TREADY]
connect_bd_net [get_bd_pins outstream_TREADY] [get_bd_pins hamming_window_0/outstream_TREADY]

current_bd_instance /microblaze_0_local_memory
connect_bd_intf_net [get_bd_intf_pins dlmb_v10/LMB_Sl_0] [get_bd_intf_pins dlmb_bram_if_cntlr/SLMB]
connect_bd_intf_net [get_bd_intf_pins ilmb_v10/LMB_Sl_0] [get_bd_intf_pins ilmb_bram_if_cntlr/SLMB]
connect_bd_intf_net [get_bd_intf_pins dlmb_bram_if_cntlr/BRAM_PORT] [get_bd_intf_pins lmb_bram/BRAM_PORTA]
connect_bd_intf_net [get_bd_intf_pins ilmb_bram_if_cntlr/BRAM_PORT] [get_bd_intf_pins lmb_bram/BRAM_PORTB]
connect_bd_intf_net [get_bd_intf_pins DLMB] [get_bd_intf_pins dlmb_v10/LMB_M]
connect_bd_intf_net [get_bd_intf_pins ILMB] [get_bd_intf_pins ilmb_v10/LMB_M]
connect_bd_net -net microblaze_0_Clk [get_bd_pins LMB_Clk] \
  [get_bd_pins dlmb_v10/LMB_Clk] [get_bd_pins dlmb_bram_if_cntlr/LMB_Clk] [get_bd_pins ilmb_v10/LMB_Clk] \
  [get_bd_pins ilmb_bram_if_cntlr/LMB_Clk]
connect_bd_net [get_bd_pins SYS_Rst] \
  [get_bd_pins dlmb_v10/SYS_Rst] [get_bd_pins dlmb_bram_if_cntlr/LMB_Rst] [get_bd_pins ilmb_v10/SYS_Rst] \
  [get_bd_pins ilmb_bram_if_cntlr/LMB_Rst]

current_bd_instance /hier_preprocess_2
connect_bd_intf_net [get_bd_intf_pins hamming_window_0/instream] [get_bd_intf_pins fir_compiler_0/M_AXIS_DATA]
connect_bd_net [get_bd_pins hamming_ap_start/dout] [get_bd_pins hamming_window_0/ap_start]
connect_bd_net -net microblaze_0_Clk [get_bd_pins ap_clk] [get_bd_pins hamming_window_0/ap_clk] [get_bd_pins fir_compiler_0/aclk]
connect_bd_net -net rst_clk_wiz_1_100M_peripheral_aresetn [get_bd_pins ap_rst_n] \
  [get_bd_pins hamming_window_0/ap_rst_n] [get_bd_pins fir_compiler_0/aresetn]
connect_bd_net [get_bd_pins hamming_window_0/outstream_TVALID] [get_bd_pins outstream_TVALID]
connect_bd_net -net hier_fft_s_axis_data_tready [get_bd_pins outstream_TREADY] [get_bd_pins hamming_window_0/outstream_TREADY]
connect_bd_net [get_bd_pins hamming_window_0/outstream_TDATA] [get_bd_pins outstream_TDATA]
connect_bd_net -net s_axis_data_tlast_1 [get_bd_pins hamming_window_0/outstream_TLAST] [get_bd_pins outstream_TLAST]
connect_bd_net [get_bd_pins S_AXIS_DATA_tdata] [get_bd_pins fir_compiler_0/s_axis_data_tdata]
connect_bd_net [get_bd_pins S_AXIS_DATA_tvalid] [get_bd_pins fir_compiler_0/s_axis_data_tvalid]

current_bd_instance /hier_fft_2
connect_bd_intf_net [get_bd_intf_pins M_AXI_S2MM] [get_bd_intf_pins axi_datamover_fft/M_AXI_S2MM]
connect_bd_net [get_bd_pins fft_all_0_imag/dout] [get_bd_pins xlconcat_0/In1]
connect_bd_net [get_bd_pins xlconcat_0/dout] [get_bd_pins xfft_0/s_axis_data_tdata]
connect_bd_net -net xlconstant_0_dout [get_bd_pins dtmv_fft_cmd/dout] [get_bd_pins axi_datamover_fft/s_axis_s2mm_cmd_tdata]
connect_bd_net [get_bd_pins fft_config/dout] [get_bd_pins xfft_0/s_axis_config_tdata]
connect_bd_net [get_bd_pins always_true/dout] [get_bd_pins xfft_0/s_axis_config_tvalid] [get_bd_pins axi_datamover_fft/s_axis_s2mm_cmd_tvalid]
connect_bd_net [get_bd_pins xfft_0/m_axis_data_tdata] [get_bd_pins axi_datamover_fft/s_axis_s2mm_tdata]
connect_bd_net [get_bd_pins xfft_0/m_axis_data_tvalid] [get_bd_pins axi_datamover_fft/s_axis_s2mm_tvalid]
connect_bd_net -net axi_datamover_0_s_axis_s2mm_tready [get_bd_pins axi_datamover_fft/s_axis_s2mm_tready] [get_bd_pins xfft_0/m_axis_data_tready]
connect_bd_net [get_bd_pins xfft_0/m_axis_data_tlast] [get_bd_pins axi_datamover_fft/s_axis_s2mm_tlast]
connect_bd_net -net xadc_wiz_0_m_axis_tdata [get_bd_pins In0] [get_bd_pins xlconcat_0/In0]
connect_bd_net -net microblaze_0_Clk [get_bd_pins m_axi_s2mm_aclk] \
  [get_bd_pins axi_datamover_fft/m_axi_s2mm_aclk] [get_bd_pins axi_datamover_fft/m_axis_s2mm_cmdsts_awclk] \
  [get_bd_pins xfft_0/aclk]
connect_bd_net -net xadc_wiz_0_m_axis_tvalid [get_bd_pins s_axis_data_tvalid] [get_bd_pins xfft_0/s_axis_data_tvalid]
connect_bd_net [get_bd_pins xfft_0/s_axis_data_tready] [get_bd_pins s_axis_data_tready]
connect_bd_net -net rst_clk_wiz_1_100M_peripheral_aresetn [get_bd_pins hier_fft_aresetn] \
  [get_bd_pins axi_datamover_fft/m_axi_s2mm_aresetn] [get_bd_pins axi_datamover_fft/m_axis_s2mm_cmdsts_aresetn] \
  [get_bd_pins xfft_0/aresetn]
connect_bd_net -net s_axis_data_tlast_0_1 [get_bd_pins s_axis_data_tlast] [get_bd_pins xfft_0/s_axis_data_tlast]
